# Altium schematic sheet 05-LogicOR.SchDoc
size A4
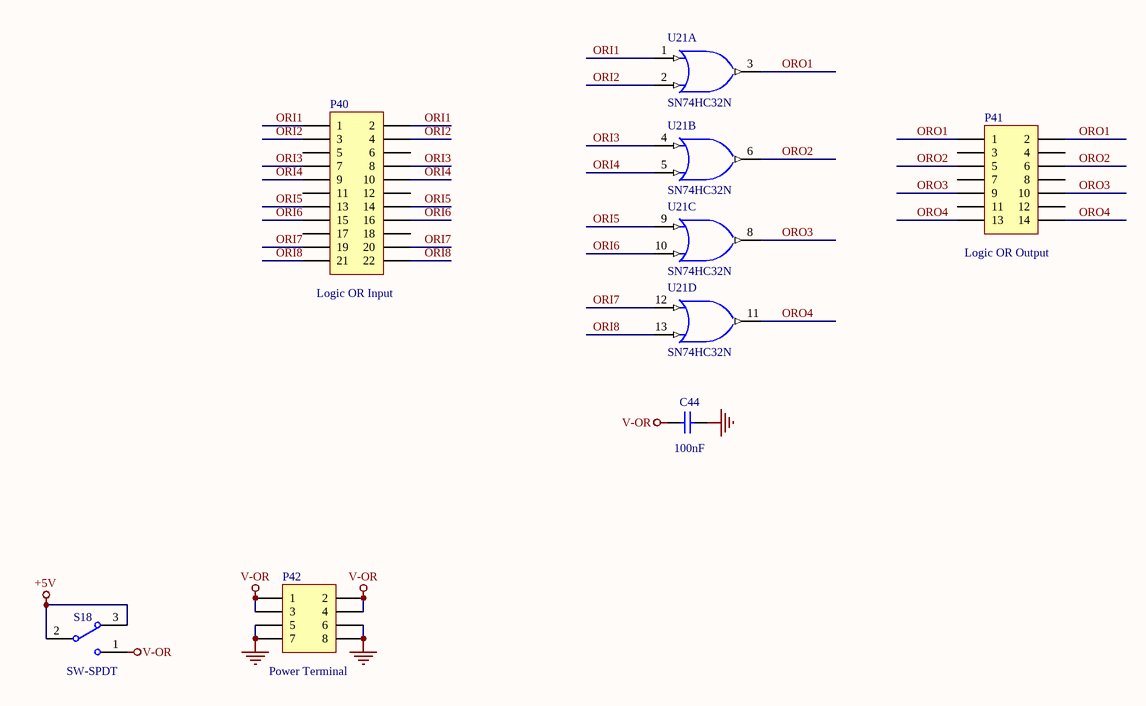
[diagram p0: 05-LogicOR.SchDoc]

## Parts
C44  value 100nF  [C-0805]  (hidden comment: 104)
P40  value Logic OR Input  [HDR2X11]  (hidden comment: Header 11X2)
P41  value Logic OR Output  [HDR2X7]  (hidden comment: H7X2)
P42  Publisher: Power Terminal  [HDR2X4]  (hidden comment: Header 4X2)
S18  SW-SPDT  [SW-DIP1SMD]
U21  SN74HC32N  [SK-DIP14-300]  (parts A,B,C,D of 4)

## Nets
+5V: S18.2 S18.3
GND: C44.2 P42.5 P42.6 P42.7 P42.8 U21.7(GND)
V-OR: C44.1 P42.1 P42.2 P42.3 P42.4 S18.1
VCC: U21.14(V-OR)
ORI1: P40.1 P40.2 U21.1(A)
ORI2: P40.3 P40.4 U21.2(B)
ORI3: P40.7 P40.8 U21.4(A)
ORI4: P40.9 P40.10 U21.5(B)
ORI5: P40.13 P40.14 U21.9(A)
ORI6: P40.15 P40.16 U21.10(B)
ORI7: P40.19 P40.20 U21.12(A)
ORI8: P40.21 P40.22 U21.13(B)
ORO1: P41.1 P41.2 U21.3(Y)
ORO2: P41.5 P41.6 U21.6(Y)
ORO3: P41.9 P41.10 U21.8(Y)
ORO4: P41.13 P41.14 U21.11(Y)

Not connected (* = marked no-connect by the designer): P40 5 6 11 12 17 18; P41 3 4 7 8 11 12

## Library data of the parts
C44 = Cap: Capacitor; Published: 8-Jun-2000; LatestRevisionDate: 17-Jul-2002; LatestRevisionNote: Re-released for DXP Platform.; PackageReference: RAD-0.3; Publisher: Altium Limited; PackageDescription: Radial Cap, Thru-Hole; 2 Leads; 0.3 in Pin Spacing
P40 = Header 11X2: Header, 11-Pin, Dual row; LatestRevisionDate: 17-Jul-2002; LatestRevisionNote: Re-released for DXP Platform.
P41 = Header 7X2: Header, 7-Pin, Dual row; LatestRevisionDate: 17-Jul-2002; LatestRevisionNote: Re-released for DXP Platform.
P42 = Header 4X2: Header, 4-Pin, Dual row; LatestRevisionDate: 17-Jul-2002; LatestRevisionNote: Re-released for DXP Platform.
S18 = SW-SPDT: SPDT Subminiature Toggle Switch, Right Angle Mounting, Vertical Actuation; Published: 24-Mar-1999; LatestRevisionDate: 17-Dec-2003; LatestRevisionNote: Schematic revised, PCB Footprint replaced.; DatasheetVersion: 05-Dec-2000; PackageReference: TL36WW15050; Publisher: Altium Limited; PackageDescription: Switch; 4 Leads; ComponentLink1Description: Manufacturer Link; ComponentLink1URL: http://www.apem.com
U21 = SN74HC32N: Quadruple 2-Input Positive-OR Gate; Published: 8-Jun-2000; LatestRevisionDate: 04-Mar-2005; LatestRevisionNote: Stylized 3D Model Added.; DatasheetVersion: May-1997; PackageVersion: Oct-1995; PackageReference: N014; Publisher: Altium Limited; PackageDescription: DIP; 14 Leads; Row Spacing 7.62 mm; Pitch 2.54 mm; ComponentLink1Description: Manufacturer Link; ComponentLink1URL: http://www.ti.com/; ComponentLink2Description: Datasheet; ComponentLink2URL: http://www-s.ti.com/sc/ds/sn74hc32.pdf